# EAGLE schematic EstufaIOT (EAGLE 9.5.2)
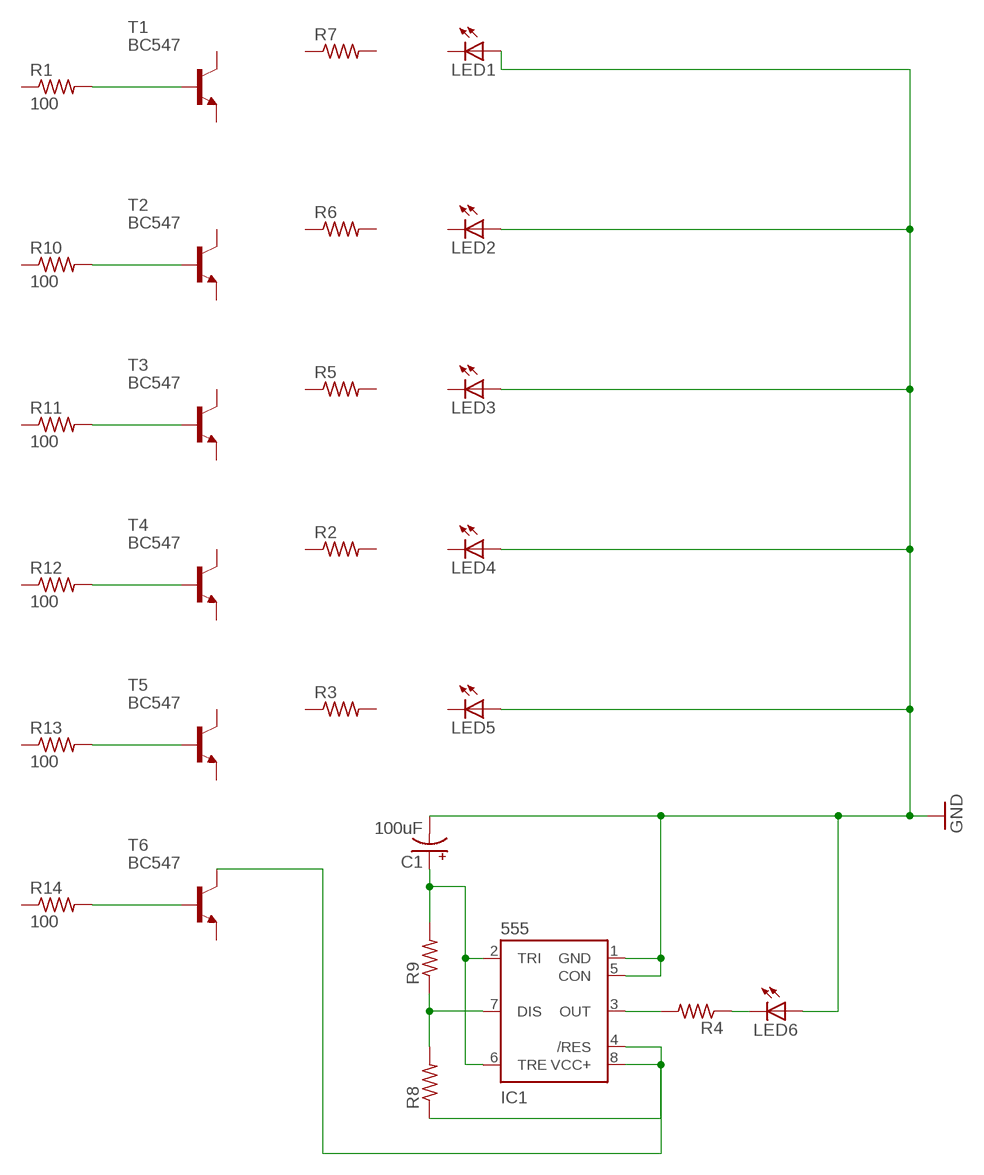
[diagram p0: schematic, sheet 1]

## Parts
C1  100uF  100UF-POLAR-RADIAL-2.5MM-25V-20%  [CPOL-RADIAL-2.5MM-6.5MM]
IC1  555  555D  [SO08]
LED1  LED5MM  [LED5MM]
LED2  LED5MM  [LED5MM]
LED3  LED5MM  [LED5MM]
LED4  LED5MM  [LED5MM]
LED5  LED5MM  [LED5MM]
LED6  LED5MM  [LED5MM]
R1  100  FLIPFLOP-RES  [0805-THM]
R2  FLIPFLOP-RES  [0805-THM]
R3  FLIPFLOP-RES  [0805-THM]
R4  FLIPFLOP-RES  [0805-THM]
R5  FLIPFLOP-RES  [0805-THM]
R6  FLIPFLOP-RES  [0805-THM]
R7  FLIPFLOP-RES  [0805-THM]
R8  FLIPFLOP-RES  [0805-THM]
R9  FLIPFLOP-RES  [0805-THM]
R10  100  FLIPFLOP-RES  [0805-THM]
R11  100  FLIPFLOP-RES  [0805-THM]
R12  100  FLIPFLOP-RES  [0805-THM]
R13  100  FLIPFLOP-RES  [0805-THM]
R14  100  FLIPFLOP-RES  [0805-THM]
T1  BC547  [TO92]
T2  BC547  [TO92]
T3  BC547  [TO92]
T4  BC547  [TO92]
T5  BC547  [TO92]
T6  BC547  [TO92]

## Nets
GND: C1.2(-) IC1.1(GND) IC1.5(CON) LED1.A LED2.A LED3.A LED4.A LED5.A LED6.A
N$1: IC1.3(OUT) R4.2
N$2: LED6.K(C) R4.1
N$3: IC1.4(/RES) IC1.8(VCC+) R8.1 T6.3(C)
N$4: IC1.7(DIS) R8.2 R9.1
N$6: C1.1(+) IC1.2(TRI) IC1.6(TRE) R9.2
N$11: R13.2 T5.2(B)
N$12: R14.2 T6.2(B)
N$13: R12.2 T4.2(B)
N$14: R11.2 T3.2(B)
N$15: R10.2 T2.2(B)
N$16: R1.2 T1.2(B)
Unconnected: LED1.K(C) LED2.K(C) LED3.K(C) LED4.K(C) LED5.K(C) R1.1 R2.1 R2.2 R3.1 R3.2 R5.1 R5.2 R6.1 R6.2 R7.1 R7.2 R10.1 R11.1 R12.1 R13.1 R14.1 T1.1(E) T1.3(C) T2.1(E) T2.3(C) T3.1(E) T3.3(C) T4.1(E) T4.3(C) T5.1(E) T5.3(C) T6.1(E)

## Library data of the parts
C1 = SparkFun-Capacitors:100UF-POLAR: 100µF polarized capacitors A capacitor is a passive two-terminal electrical component used to store electrical energy temporarily in an electric field.; PROD_ID: CAP-08439
IC1 = SparkFun-IC-Special-Function:555: General purpose bipolar Timer Datasheet <http://www.sparkfun.com/datasheets/Components/General/ne555.pdf> SparkFun Products SparkFun SparkPunk Sequencer Kit <https://www.sparkfun.com/products/12707> (KIT-12707) Storefront Component: 555 Timer <https://www.sparkfun.com/products/9273> (COM-09273) Two parts valid for production: VFP: IC-11930 (M7555 PTH) VFP: IC-09173 (555 PTH) - Preferred; PROD_ID: NA-XXXXX
LED1-LED6 = adafruit:LED: LED OSRAM: - CHIPLED LG R971, LG N971, LY N971, LG Q971, LY Q971, LO R971, LY R971 LH N974, LH R974 LS Q976, LO Q976, LY Q976 LO Q996 - Hyper CHIPLED LW Q18S LB Q993, LB Q99A, LB R99A - SideLED LS A670, LO A670, LY A670, LG A670, LP A670 LB A673, LV A673, LT A673, LW A673 LH A674 LY A675 LS A676, LA A676, LO A676, LY A676, LW A676 LS A679, LY A679, LG A679 - Hyper Micro SIDELED® LS Y876, LA Y876, LO Y876, LY Y876 LT Y87S - SmartLED LW L88C, LW L88S LB L89C, LB L89S, LG L890 LS L89K, LO L89K, LY L89K LS L896, LA L896, LO L896, LY L896 - TOPLED LS T670, LO T670, LY T670, LG T670, LP T670 LSG T670, LSP T670, LSY T670, LOP T670, LYG T670 LG T671, LOG T671, LSG T671 LB T673, LV T673, LT T673, LW T673 LH T674 LS T676, LA T676, LO T676, LY T676, LB T676, LH T676, LSB T676, LW T676 LB T67C, LV T67C, LT T67C, LS T67K, LO T67K, LY T67K, LW E67C LS E67B, LA E67B, LO E67B, LY E67B, LB E67C, LV E67C, LT E67C LW T67C LS T679, LY T679, LG T679 LS T770, LO T770, LY T770, LG T770, LP T770 LB T773, LV T773, LT T773, LW T773 LH T774 LS E675, LA E675, LY E675, LS T675 LS T776, LA T776, LO T776, LY T776, LB T776 LHGB T686 LT T68C, LB T68C - Hyper Mini TOPLED® LB M676 - Mini TOPLED Santana® LG M470 LS M47K, LO M47K, LY M47K Source: http://www.osram.convergy.de/
R1-R14 = adafruit:FLIPFLOP-RES: Flip Flop resistor An 0805 resistor inside a standard 1/4W 5% resistor. Makes for easy mods
T1-T6 = transistor:BC547: NPN TRANSISTOR